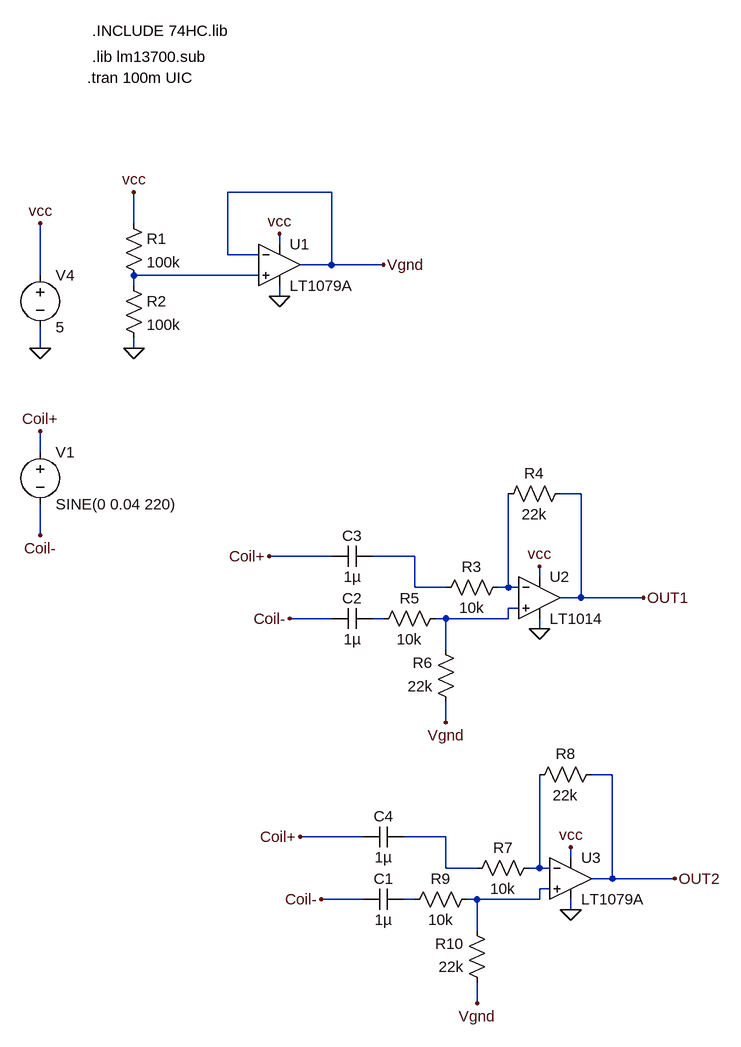
[diagram p0: schematic Single_OpAmpSim.asc]
Single_OpAmpSim.asc, the LTspice schematic file:
Version 4
SHEET 1 3368 3520
WIRE 336 288 176 288
WIRE 32 336 32 288
WIRE 256 368 256 352
WIRE 176 384 176 288
WIRE 224 384 176 384
WIRE 336 400 336 288
WIRE 336 400 288 400
WIRE 416 400 336 400
WIRE -112 416 -112 336
WIRE 224 416 32 416
WIRE 32 432 32 416
WIRE 256 448 256 432
WIRE -112 528 -112 496
WIRE 32 528 32 512
WIRE -112 688 -112 656
WIRE 720 752 688 752
WIRE -112 816 -112 768
WIRE 336 848 240 848
WIRE 464 848 400 848
WIRE 656 880 656 864
WIRE 464 896 464 848
WIRE 512 896 464 896
WIRE 608 896 608 752
WIRE 608 896 592 896
WIRE 624 896 608 896
WIRE 720 912 720 752
WIRE 720 912 688 912
WIRE 816 912 720 912
WIRE 624 928 608 928
WIRE 336 944 272 944
WIRE 416 944 400 944
WIRE 512 944 496 944
WIRE 608 944 608 928
WIRE 608 944 512 944
WIRE 656 960 656 944
WIRE 512 992 512 944
WIRE 512 1104 512 1072
WIRE 768 1184 736 1184
WIRE 384 1280 288 1280
WIRE 512 1280 448 1280
WIRE 704 1312 704 1296
WIRE 512 1328 512 1280
WIRE 560 1328 512 1328
WIRE 656 1328 656 1184
WIRE 656 1328 640 1328
WIRE 672 1328 656 1328
WIRE 768 1344 768 1184
WIRE 768 1344 736 1344
WIRE 864 1344 768 1344
WIRE 672 1360 656 1360
WIRE 384 1376 320 1376
WIRE 464 1376 448 1376
WIRE 560 1376 544 1376
WIRE 656 1376 656 1360
WIRE 656 1376 560 1376
WIRE 704 1392 704 1376
WIRE 560 1424 560 1376
WIRE 560 1536 560 1504
FLAG -112 528 0
FLAG -112 336 vcc
FLAG -112 656 Coil+
FLAG -112 816 Coil-
FLAG 256 352 vcc
FLAG 416 400 Vgnd
FLAG 256 448 0
FLAG 32 528 0
FLAG 32 288 vcc
FLAG 656 864 vcc
FLAG 656 960 0
FLAG 512 1104 Vgnd
FLAG 240 848 Coil+
FLAG 272 944 Coil-
FLAG 816 912 OUT1
FLAG 704 1296 vcc
FLAG 704 1392 0
FLAG 560 1536 Vgnd
FLAG 288 1280 Coil+
FLAG 320 1376 Coil-
FLAG 864 1344 OUT2
SYMBOL voltage -112 400 R0
SYMATTR InstName V4
SYMATTR Value 5
SYMBOL voltage -112 672 R0
SYMATTR InstName V1
SYMATTR Value SINE(0 0.04 220)
SYMBOL OpAmps/LT1079A 256 336 R0
SYMATTR InstName U1
SYMBOL res 16 320 R0
SYMATTR InstName R1
SYMATTR Value 100k
SYMBOL res 16 416 R0
SYMATTR InstName R2
SYMATTR Value 100k
SYMBOL res 608 880 R90
WINDOW 0 0 56 VBottom 2
WINDOW 3 32 56 VTop 2
SYMATTR InstName R3
SYMATTR Value 10k
SYMBOL res 704 736 R90
WINDOW 0 0 56 VBottom 2
WINDOW 3 32 56 VTop 2
SYMATTR InstName R4
SYMATTR Value 22k
SYMBOL res 512 928 R90
WINDOW 0 0 56 VBottom 2
WINDOW 3 32 56 VTop 2
SYMATTR InstName R5
SYMATTR Value 10k
SYMBOL res 528 1088 R180
WINDOW 0 36 76 Left 2
WINDOW 3 36 40 Left 2
SYMATTR InstName R6
SYMATTR Value 22k
SYMBOL cap 400 928 R90
WINDOW 0 0 32 VBottom 2
WINDOW 3 32 32 VTop 2
SYMATTR InstName C2
SYMATTR Value 1µ
SYMBOL cap 400 832 R90
WINDOW 0 0 32 VBottom 2
WINDOW 3 32 32 VTop 2
SYMATTR InstName C3
SYMATTR Value 1µ
SYMBOL OpAmps/LT1079A 704 1280 R0
SYMATTR InstName U3
SYMBOL res 656 1312 R90
WINDOW 0 0 56 VBottom 2
WINDOW 3 32 56 VTop 2
SYMATTR InstName R7
SYMATTR Value 10k
SYMBOL res 752 1168 R90
WINDOW 0 0 56 VBottom 2
WINDOW 3 32 56 VTop 2
SYMATTR InstName R8
SYMATTR Value 22k
SYMBOL res 560 1360 R90
WINDOW 0 0 56 VBottom 2
WINDOW 3 32 56 VTop 2
SYMATTR InstName R9
SYMATTR Value 10k
SYMBOL res 576 1520 R180
WINDOW 0 36 76 Left 2
WINDOW 3 36 40 Left 2
SYMATTR InstName R10
SYMATTR Value 22k
SYMBOL cap 448 1360 R90
WINDOW 0 0 32 VBottom 2
WINDOW 3 32 32 VTop 2
SYMATTR InstName C1
SYMATTR Value 1µ
SYMBOL cap 448 1264 R90
WINDOW 0 0 32 VBottom 2
WINDOW 3 32 32 VTop 2
SYMATTR InstName C4
SYMATTR Value 1µ
SYMBOL OpAmps/LT1014 656 848 R0
SYMATTR InstName U2
TEXT -40 112 Left 2 !.tran 100m UIC
TEXT -32 80 Left 2 !.lib lm13700.sub
TEXT -32 40 Left 2 !.INCLUDE 74HC.lib

The netlist it stands for:
* Single_OpAmpSim.asc
V4 vcc 0 5
V1 Coil+ Coil- SINE(0 0.04 220)
XU1 N001 Vgnd vcc 0 Vgnd LT1079A  ; pins In+ In- V+ V- OUT
R1 vcc N001 100k
R2 N001 0 100k
R3 N003 N002 10k
R4 OUT1 N003 22k
R5 N004 N005 10k
R6 Vgnd N004 22k
C2 N005 Coil- 1µ
C3 N002 Coil+ 1µ
XU3 N008 N007 vcc 0 OUT2 LT1079A  ; pins In+ In- V+ V- OUT
R7 N007 N006 10k
R8 OUT2 N007 22k
R9 N008 N009 10k
R10 Vgnd N008 22k
C1 N009 Coil- 1µ
C4 N006 Coil+ 1µ
XU2 N004 N003 vcc 0 OUT1 LT1014  ; pins In+ In- V+ V- OUT
.tran 100m UIC
.lib lm13700.sub
.INCLUDE 74HC.lib
.backanno
.end